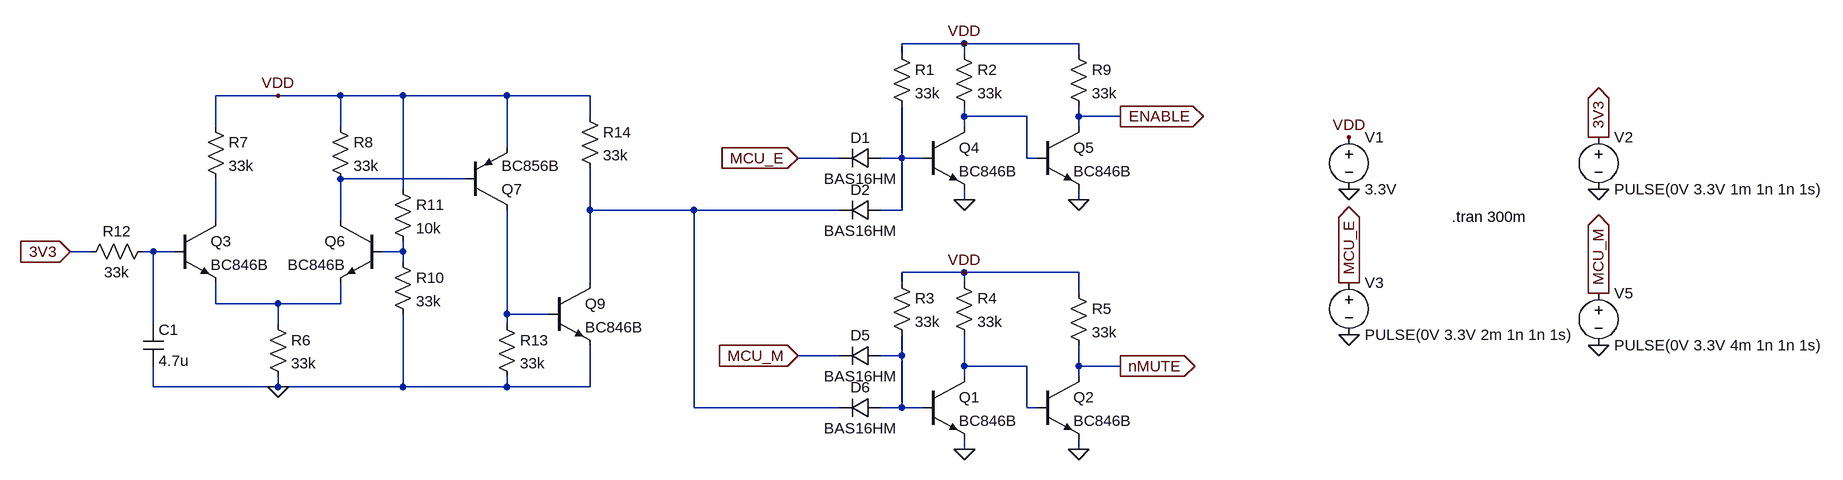
[diagram p0: schematic Daughterboard Enable-Mute logic.asc]
Daughterboard Enable-Mute logic.asc, the LTspice schematic file:
Version 4
SHEET 1 1736 804
WIRE 160 -16 64 -16
WIRE 336 -16 160 -16
WIRE 64 0 64 -16
WIRE 160 0 160 -16
WIRE 336 0 336 -16
WIRE -896 64 -992 64
WIRE -800 64 -896 64
WIRE -704 64 -800 64
WIRE -544 64 -704 64
WIRE -416 64 -544 64
WIRE -416 96 -416 64
WIRE 160 96 160 80
WIRE 256 96 160 96
WIRE 336 96 336 80
WIRE 400 96 336 96
WIRE -992 112 -992 64
WIRE -800 112 -800 64
WIRE 160 112 160 96
WIRE 336 112 336 96
WIRE -544 144 -544 64
WIRE -32 160 -96 160
WIRE 64 160 64 80
WIRE 64 160 32 160
WIRE 96 160 64 160
WIRE 256 160 256 96
WIRE 272 160 256 160
WIRE -608 192 -800 192
WIRE -704 208 -704 64
WIRE 160 224 160 208
WIRE 336 224 336 208
WIRE -416 240 -416 176
WIRE -256 240 -416 240
WIRE -32 240 -256 240
WIRE 64 240 64 160
WIRE 64 240 32 240
WIRE -992 256 -992 192
WIRE -800 256 -800 192
WIRE -1184 304 -1216 304
WIRE -1088 304 -1104 304
WIRE -1056 304 -1088 304
WIRE -704 304 -704 288
WIRE -704 304 -736 304
WIRE -704 320 -704 304
WIRE 160 336 64 336
WIRE 336 336 160 336
WIRE -416 352 -416 240
WIRE 64 352 64 336
WIRE 160 352 160 336
WIRE 336 368 336 336
WIRE -992 384 -992 352
WIRE -896 384 -992 384
WIRE -800 384 -800 352
WIRE -800 384 -896 384
WIRE -544 400 -544 240
WIRE -480 400 -544 400
WIRE -1088 416 -1088 304
WIRE -896 416 -896 384
WIRE -544 416 -544 400
WIRE -32 464 -96 464
WIRE 64 464 64 432
WIRE 64 464 32 464
WIRE 160 480 160 432
WIRE 256 480 160 480
WIRE 336 480 336 448
WIRE 400 480 336 480
WIRE 160 496 160 480
WIRE 336 496 336 480
WIRE -1088 512 -1088 480
WIRE -896 512 -896 496
WIRE -896 512 -1088 512
WIRE -704 512 -704 400
WIRE -704 512 -896 512
WIRE -544 512 -544 496
WIRE -544 512 -704 512
WIRE -416 512 -416 448
WIRE -416 512 -544 512
WIRE -256 544 -256 240
WIRE -32 544 -256 544
WIRE 64 544 64 464
WIRE 64 544 32 544
WIRE 96 544 64 544
WIRE 256 544 256 480
WIRE 272 544 256 544
WIRE 160 608 160 592
WIRE 336 608 336 592
FLAG 160 224 0
FLAG 752 128 VDD
FLAG 752 208 0
FLAG 160 -16 VDD
FLAG 160 336 VDD
FLAG 400 96 ENABLE
IOPIN 400 96 Out
FLAG 400 480 nMUTE
IOPIN 400 480 Out
FLAG -96 160 MCU_E
IOPIN -96 160 In
FLAG -96 464 MCU_M
IOPIN -96 464 In
FLAG 1136 128 3V3
IOPIN 1136 128 Out
FLAG 1136 208 0
FLAG 752 352 MCU_E
IOPIN 752 352 Out
FLAG 752 432 0
FLAG 1136 368 MCU_M
IOPIN 1136 368 Out
FLAG 1136 448 0
FLAG 336 224 0
FLAG 160 608 0
FLAG 336 608 0
FLAG -896 512 0
FLAG -896 64 VDD
FLAG -1216 304 3V3
IOPIN -1216 304 In
SYMBOL diode 32 144 R90
WINDOW 0 0 32 VBottom 2
WINDOW 3 32 32 VTop 2
SYMATTR InstName D1
SYMATTR Value BAS16HM
SYMBOL res 48 -16 R0
SYMATTR InstName R1
SYMATTR Value 33k
SYMBOL voltage 752 112 R0
WINDOW 123 0 0 Left 0
WINDOW 39 0 0 Left 0
SYMATTR InstName V1
SYMATTR Value 3.3V
SYMBOL res 144 -16 R0
SYMATTR InstName R2
SYMATTR Value 33k
SYMBOL res 48 336 R0
SYMATTR InstName R3
SYMATTR Value 33k
SYMBOL res 144 336 R0
SYMATTR InstName R4
SYMATTR Value 33k
SYMBOL diode 32 224 R90
WINDOW 0 0 32 VBottom 2
WINDOW 3 32 32 VTop 2
SYMATTR InstName D2
SYMATTR Value BAS16HM
SYMBOL diode 32 448 R90
WINDOW 0 0 32 VBottom 2
WINDOW 3 32 32 VTop 2
SYMATTR InstName D5
SYMATTR Value BAS16HM
SYMBOL diode 32 528 R90
WINDOW 0 0 32 VBottom 2
WINDOW 3 32 32 VTop 2
SYMATTR InstName D6
SYMATTR Value BAS16HM
SYMBOL voltage 1136 112 R0
WINDOW 123 0 0 Left 0
WINDOW 39 0 0 Left 0
SYMATTR InstName V2
SYMATTR Value PULSE(0V 3.3V 1m 1n 1n 1s)
SYMBOL voltage 752 336 R0
WINDOW 123 0 0 Left 0
WINDOW 39 0 0 Left 0
SYMATTR InstName V3
SYMATTR Value PULSE(0V 3.3V 2m 1n 1n 1s)
SYMBOL voltage 1136 352 R0
WINDOW 123 0 0 Left 0
WINDOW 39 0 0 Left 0
SYMATTR InstName V5
SYMATTR Value PULSE(0V 3.3V 4m 1n 1n 1s)
SYMBOL npn 96 112 R0
SYMATTR InstName Q4
SYMATTR Value BC846B
SYMBOL npn 272 112 R0
SYMATTR InstName Q5
SYMATTR Value BC846B
SYMBOL res 320 -16 R0
SYMATTR InstName R9
SYMATTR Value 33k
SYMBOL npn 96 496 R0
SYMATTR InstName Q1
SYMATTR Value BC846B
SYMBOL npn 272 496 R0
SYMATTR InstName Q2
SYMATTR Value BC846B
SYMBOL res 320 352 R0
SYMATTR InstName R5
SYMATTR Value 33k
SYMBOL npn -1056 256 R0
SYMATTR InstName Q3
SYMATTR Value BC846B
SYMBOL npn -736 256 M0
SYMATTR InstName Q6
SYMATTR Value BC846B
SYMBOL res -912 400 R0
SYMATTR InstName R6
SYMATTR Value 33k
SYMBOL res -1008 96 R0
SYMATTR InstName R7
SYMATTR Value 33k
SYMBOL res -816 96 R0
SYMATTR InstName R8
SYMATTR Value 33k
SYMBOL res -720 304 R0
SYMATTR InstName R10
SYMATTR Value 33k
SYMBOL res -720 192 R0
SYMATTR InstName R11
SYMATTR Value 10k
SYMBOL cap -1104 416 R0
SYMATTR InstName C1
SYMATTR Value 4.7u
SYMBOL res -1088 288 R90
WINDOW 0 0 56 VBottom 2
WINDOW 3 32 56 VTop 2
SYMATTR InstName R12
SYMATTR Value 33k
SYMBOL pnp -608 240 M180
SYMATTR InstName Q7
SYMATTR Value BC856B
SYMBOL res -560 400 R0
SYMATTR InstName R13
SYMATTR Value 33k
SYMBOL res -432 80 R0
SYMATTR InstName R14
SYMATTR Value 33k
SYMBOL npn -480 352 R0
SYMATTR InstName Q9
SYMATTR Value BC846B
TEXT 910 250 Left 2 !.tran 300m

The netlist it stands for:
* Daughterboard Enable-Mute logic.asc
D1 N002 MCU_E BAS16HM
R1 VDD N002 33k
V1 VDD 0 3.3V
R2 VDD N001 33k
R3 VDD N010 33k
R4 VDD N011 33k
D2 N002 N004 BAS16HM
D5 N010 MCU_M BAS16HM
D6 N010 N004 BAS16HM
V2 3V3 0 PULSE(0V 3.3V 1m 1n 1n 1s)
V3 MCU_E 0 PULSE(0V 3.3V 2m 1n 1n 1s)
V5 MCU_M 0 PULSE(0V 3.3V 4m 1n 1n 1s)
Q4 N001 N002 0 0 BC846B
Q5 ENABLE N001 0 0 BC846B
R9 VDD ENABLE 33k
Q1 N011 N010 0 0 BC846B
Q2 nMUTE N011 0 0 BC846B
R5 VDD nMUTE 33k
Q3 N005 N006 N008 0 BC846B
Q6 N003 N007 N008 0 BC846B
R6 N008 0 33k
R7 VDD N005 33k
R8 VDD N003 33k
R10 N007 0 33k
R11 VDD N007 10k
C1 N006 0 4.7u
R12 N006 3V3 33k
Q7 N009 N003 VDD 0 BC856B
R13 N009 0 33k
R14 VDD N004 33k
Q9 N004 N009 0 0 BC846B
.model D D
.lib standard.dio
.model NPN NPN
.model PNP PNP
.lib standard.bjt
.tran 300m
.backanno
.end